# Altium schematic sheet VCM-MCU.SchDoc: MCU
size A4; SheetNumber: 2; SheetTotal: 3
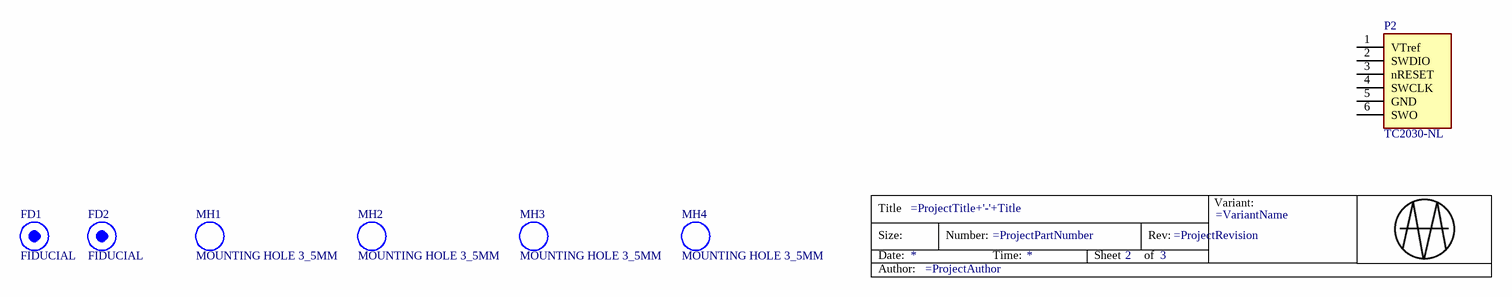
[diagram p0: VCM-MCU.SchDoc]

## Parts
?  Total Sheets: 3  Sheet Number: 2  (hidden comment: Title Block Logo)  (graphical)
FD1  FIDUCIAL  [FIDUCIAL_2MM]  (no BOM)
FD2  FIDUCIAL  [FIDUCIAL_2MM]  (no BOM)
MH1  MOUNTING HOLE 3_5MM  [MOUNTING-HOLE-3.5MM]  (no BOM)
MH2  MOUNTING HOLE 3_5MM  [MOUNTING-HOLE-3.5MM]  (no BOM)
MH3  MOUNTING HOLE 3_5MM  [MOUNTING-HOLE-3.5MM]  (no BOM)
MH4  MOUNTING HOLE 3_5MM  [MOUNTING-HOLE-3.5MM]  (no BOM)
P2  TC2030-NL  [TC2030-NL]  (no BOM)

## Nets

Not connected (* = marked no-connect by the designer): P2 1(VTref) 2(SWDIO) 3(nRESET) 4(SWCLK) 5(GND) 6(SWO)

## Notes on the sheet
- Title
- Size:
- Date:
- A4
- Number:
- Time:
- Revision:
- Sheet
- of
- File:
- (in symbol Title Block Logo) Variant:; Title; Size:; Number:; Rev:; Date:; Time:; Sheet; of; Author:

## Library data of the parts
MH1-MH4 = MOUNTING HOLE 3.5MM
? = Title Block Logo: Sheet Title: =ProjectTitle+'-'+Title; Document Number: =ProjectPartNumber; Revision Number: =ProjectRevision; Organization Address 1: =VariantName; Date: *; Time: *; Document Path and Name: =ProjectAuthor